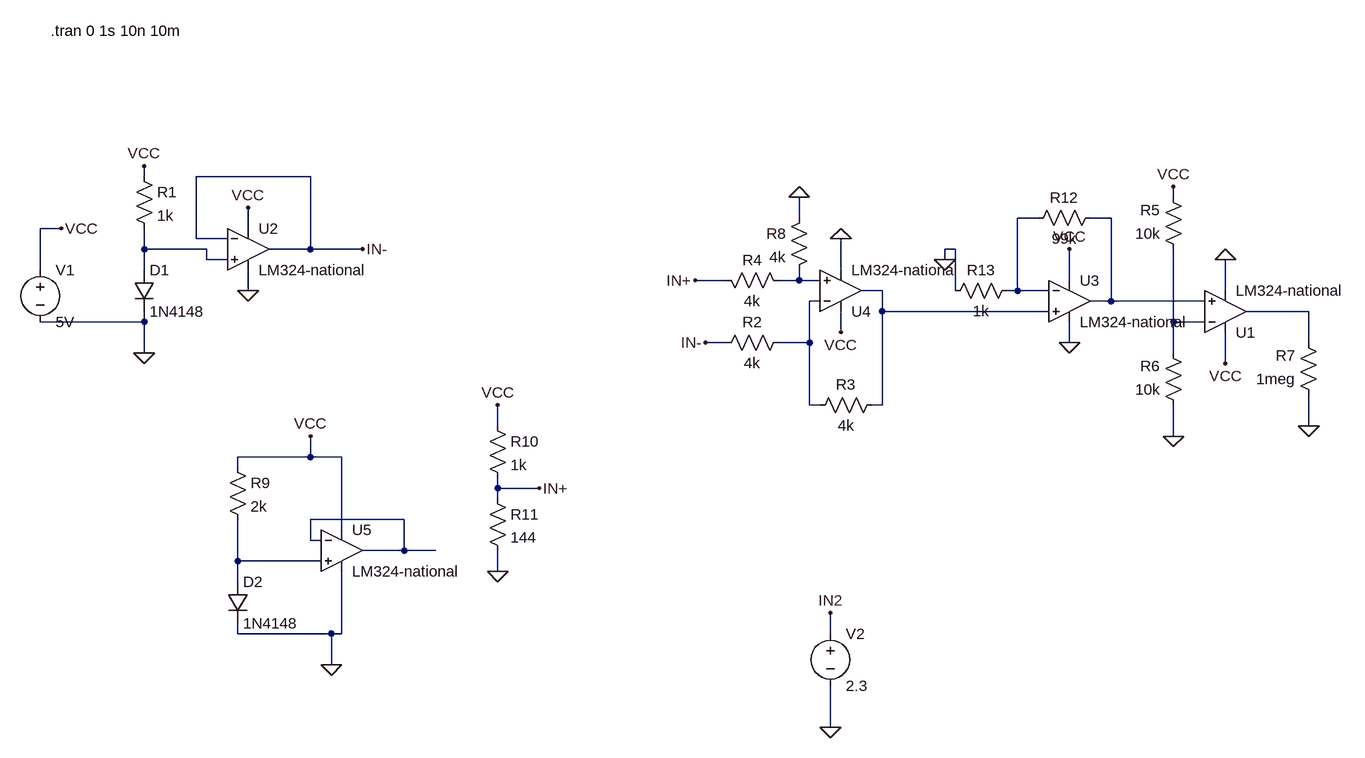
[diagram p0: schematic Draft2.asc]
Draft2.asc, the LTspice schematic file:
Version 4
SHEET 1 1028 788
WIRE -784 -112 -784 -128
WIRE -528 -112 -704 -112
WIRE 800 -80 800 -96
WIRE 224 -48 224 -80
WIRE 592 -48 560 -48
WIRE 704 -48 672 -48
WIRE -912 -32 -944 -32
WIRE -624 -32 -624 -64
WIRE -704 -16 -704 -112
WIRE -656 -16 -704 -16
WIRE -784 0 -784 -32
WIRE -688 0 -784 0
WIRE -528 0 -528 -112
WIRE -528 0 -592 0
WIRE -448 0 -528 0
WIRE 464 0 448 0
WIRE -688 16 -688 0
WIRE -656 16 -688 16
WIRE 448 16 448 0
WIRE -944 32 -944 -32
WIRE -784 32 -784 0
WIRE 288 32 288 -16
WIRE 112 48 64 48
WIRE 224 48 224 32
WIRE 224 48 192 48
WIRE 256 48 224 48
WIRE 640 48 640 0
WIRE -624 64 -624 32
WIRE 352 64 320 64
WIRE 464 64 464 0
WIRE 560 64 560 -48
WIRE 560 64 544 64
WIRE 608 64 560 64
WIRE 880 64 880 16
WIRE 256 80 240 80
WIRE 704 80 704 -48
WIRE 704 80 672 80
WIRE 848 80 704 80
WIRE 352 96 352 64
WIRE 608 96 352 96
WIRE 1008 96 912 96
WIRE -784 112 -784 96
WIRE -784 112 -944 112
WIRE 800 112 800 0
WIRE 848 112 800 112
WIRE 288 128 288 96
WIRE 112 144 80 144
WIRE 240 144 240 80
WIRE 240 144 192 144
WIRE 640 144 640 112
WIRE 1008 144 1008 96
WIRE -784 160 -784 112
WIRE 800 160 800 112
WIRE 880 176 880 128
WIRE 240 240 240 144
WIRE 256 240 240 240
WIRE 352 240 352 96
WIRE 352 240 336 240
WIRE -240 272 -240 240
WIRE 1008 272 1008 224
WIRE 800 288 800 240
WIRE -528 320 -528 288
WIRE -528 320 -640 320
WIRE -480 320 -528 320
WIRE -640 336 -640 320
WIRE -240 368 -240 352
WIRE -176 368 -240 368
WIRE -240 384 -240 368
WIRE -384 416 -528 416
WIRE -480 432 -480 320
WIRE -528 448 -528 416
WIRE -512 448 -528 448
WIRE -384 464 -384 416
WIRE -384 464 -448 464
WIRE -336 464 -384 464
WIRE -640 480 -640 416
WIRE -512 480 -640 480
WIRE -240 496 -240 464
WIRE -640 512 -640 480
WIRE -640 592 -640 576
WIRE -496 592 -640 592
WIRE -480 592 -480 496
WIRE -480 592 -496 592
WIRE 272 592 272 560
WIRE -496 640 -496 592
WIRE 272 736 272 672
FLAG -784 160 0
FLAG -496 640 0
FLAG 800 288 0
FLAG 1008 272 0
FLAG 800 -96 VCC
FLAG 880 176 VCC
FLAG 288 128 VCC
FLAG -784 -128 VCC
FLAG -912 -32 VCC
FLAG 288 -16 0
FLAG 880 16 0
FLAG -624 64 0
FLAG 224 -80 0
FLAG -624 -64 VCC
FLAG -528 288 VCC
FLAG -176 368 IN+
FLAG 80 144 IN-
FLAG 272 736 0
FLAG 272 560 IN2
FLAG 64 48 IN+
FLAG -448 0 IN-
FLAG -240 496 0
FLAG -240 240 VCC
FLAG 448 16 0
FLAG 640 144 0
FLAG 640 0 VCC
SYMBOL diode -800 32 R0
SYMATTR InstName D1
SYMATTR Value 1N4148
SYMBOL res -800 -128 R0
SYMATTR InstName R1
SYMATTR Value 1k
SYMBOL res 208 128 R90
WINDOW 0 0 56 VBottom 2
WINDOW 3 32 56 VTop 2
SYMATTR InstName R2
SYMATTR Value 4k
SYMBOL res 352 224 R90
WINDOW 0 0 56 VBottom 2
WINDOW 3 32 56 VTop 2
SYMATTR InstName R3
SYMATTR Value 4k
SYMBOL res 816 16 R180
WINDOW 0 36 76 Left 2
WINDOW 3 36 40 Left 2
SYMATTR InstName R5
SYMATTR Value 10k
SYMBOL res 816 256 R180
WINDOW 0 36 76 Left 2
WINDOW 3 36 40 Left 2
SYMATTR InstName R6
SYMATTR Value 10k
SYMBOL res 1024 240 R180
WINDOW 0 36 76 Left 2
WINDOW 3 36 40 Left 2
SYMATTR InstName R7
SYMATTR Value 1meg
SYMBOL voltage -944 16 R0
WINDOW 123 0 0 Left 2
WINDOW 39 0 0 Left 2
SYMATTR InstName V1
SYMATTR Value 5V
SYMBOL res 208 64 M270
WINDOW 0 32 56 VTop 2
WINDOW 3 0 56 VBottom 2
SYMATTR InstName R4
SYMATTR Value 4k
SYMBOL res 240 -64 M0
SYMATTR InstName R8
SYMATTR Value 4k
SYMBOL res -656 320 R0
SYMATTR InstName R9
SYMATTR Value 2k
SYMBOL diode -656 512 R0
SYMATTR InstName D2
SYMATTR Value 1N4148
SYMBOL voltage 272 576 R0
WINDOW 123 0 0 Left 2
WINDOW 39 0 0 Left 2
SYMATTR InstName V2
SYMATTR Value 2.3
SYMBOL LM324-national -480 400 R0
SYMATTR InstName U5
SYMBOL LM324-national 288 128 M180
SYMATTR InstName U4
SYMBOL LM324-national 880 160 M180
SYMATTR InstName U1
SYMBOL LM324-national -624 -64 R0
SYMATTR InstName U2
SYMBOL res -256 256 R0
SYMATTR InstName R10
SYMATTR Value 1k
SYMBOL res -256 368 R0
SYMATTR InstName R11
SYMATTR Value 144
SYMBOL LM324-national 640 16 R0
SYMATTR InstName U3
SYMBOL res 688 -64 R90
WINDOW 0 0 56 VBottom 2
WINDOW 3 32 56 VTop 2
SYMATTR InstName R12
SYMATTR Value 99k
SYMBOL res 560 48 R90
WINDOW 0 0 56 VBottom 2
WINDOW 3 32 56 VTop 2
SYMATTR InstName R13
SYMATTR Value 1k
TEXT -928 -336 Left 2 !.tran 0 1s 10n 10m

The netlist it stands for:
* Draft2.asc
D1 N003 0 1N4148
R1 VCC N003 1k
R2 N006 IN- 4k
R3 N005 N006 4k
R5 N008 VCC 10k
R6 0 N008 10k
R7 0 N007 1meg
V1 VCC 0 5V
R4 N004 IN+ 4k
R8 0 N004 4k
R9 VCC N010 2k
D2 N010 0 1N4148
V2 IN2 0 2.3
* U5: LM324-national (symbol LM324-national not available, pins judged from their places): In+=N010 In-=N009 V+=VCC V-=0 OUT=N009
* U4: LM324-national (symbol LM324-national not available, pins judged from their places): In+=N004 In-=N006 V+=VCC V-=0 OUT=N005
* U1: LM324-national (symbol LM324-national not available, pins judged from their places): In+=N002 In-=N008 V+=VCC V-=0 OUT=N007
* U2: LM324-national (symbol LM324-national not available, pins judged from their places): In+=N003 In-=IN- V+=VCC V-=0 OUT=IN-
R10 VCC IN+ 1k
R11 IN+ 0 144
* U3: LM324-national (symbol LM324-national not available, pins judged from their places): In+=N005 In-=N001 V+=VCC V-=0 OUT=N002
R12 N002 N001 99k
R13 N001 0 1k
.model D D
.lib standard.dio
.tran 0 1s 10n 10m
.backanno
.end